# Altium schematic sheet Power-line.SchDoc
size A4; SheetNumber: 3; SheetTotal: 3
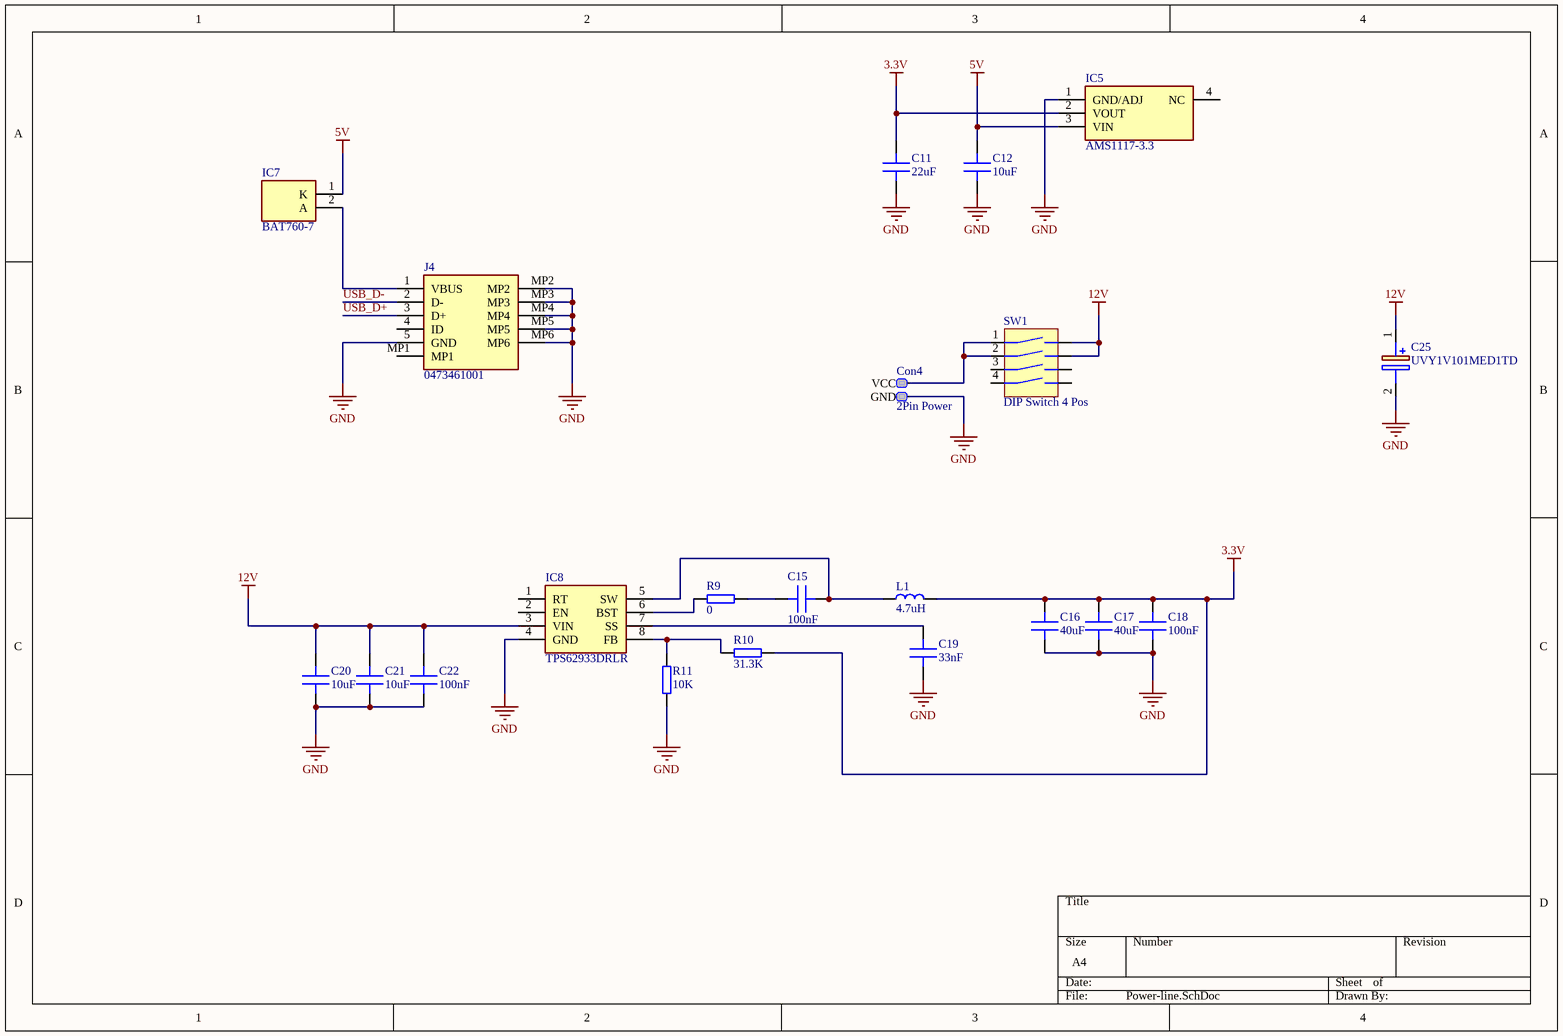
[diagram p0: Power-line.SchDoc]

## Parts
C11  22uF  [C 0805]
C12  10uF  [C 0805]
C15  100nF  [C 0402]
C16  40uF  [C 1206]
C17  40uF  [C 1206]
C18  100nF  [C 0603]
C19  33nF  [C 0402]
C20  10uF  [C 1206]
C21  10uF  [C 1206]
C22  100nF  [C 0603]
C25  UVY1V101MED1TD  [CAPPRD250W50D655H1250]
Con4  2Pin Power  [B2B-ZR-SM4A-TF]
IC5  AMS1117-3.3  [SOT229P700X180-4N]
IC7  BAT760-7  [SOD2513X120N]
IC8  TPS62933DRLR  [SOTFL50P160X60-8N]
J4  0473461001  [0473461001]
L1  4.7uH  [HPI0630]
R9  0  [R 0402]
R10  31.3K  [R 0402]
R11  10K  [R 0402]
SW1  DIP Switch 4 Pos  [DIP Switch 4 pos 2.54mm]

## Nets
3.3V: C11.1 C16.1 C17.1 C18.1 IC5.2(VOUT) L1.2 R10.1
5V: C12.1 IC5.3(VIN) IC7.1(K)
12V: C20.1 C21.1 C22.1 C25.1(+) IC8.3(VIN) SW1.7 SW1.8
GND: C11.2 C12.2 C16.2 C17.2 C18.2 C19.2 C20.2 C21.2 C22.2 C25.2(-) Con4.2(GND) IC5.1(GND/ADJ) IC8.4(GND) J4.5(GND) J4.MP2 J4.MP3 J4.MP4 J4.MP5 J4.MP6 R11.1
USB_D+: J4.3(D+)
USB_D-: J4.2(D-)
NetC15_1: C15.1 R9.1
NetC15_2: C15.2 IC8.5(SW) L1.1
NetC19_1: C19.1 IC8.7(SS)
NetCon4_1: Con4.1(VCC) SW1.1 SW1.2
NetIC7_2: IC7.2(A) J4.1(VBUS)
NetIC8_6: IC8.6(BST) R9.2
NetIC8_8: IC8.8(FB) R10.2 R11.2

Not connected (* = marked no-connect by the designer): IC5 4(NC); IC8 1(RT) 2(EN); J4 4(ID) MP1; SW1 3 4 5 6

## Library data of the parts
C11 C12 C15-C22 = Capacitor: MLCC Capacitor
C25 = UVY1V101MED1TD: Capacitor Polarised; Manufacturer_Name: Nichicon; Datasheet Link: http://nichicon-us.com/english/products/pdfs/e-uvy.pdf; Height: 12.5mm; Manufacturer_Part_Number: UVY1V101MED1TD; Arrow Part Number: UVY1V101MED1TD; Arrow Price/Stock: https://www.arrow.com/en/products/uvy1v101med1td/nichicon
IC5 = AMS1117-3.3: Integrated Circuit; Manufacturer_Name: Advanced; Datasheet Link: https://datasheet.datasheetarchive.com/originals/distributors/Datasheets-28/DSA-550594.pdf; Height: 1.8mm; Manufacturer_Part_Number: AMS1117-3.3
IC7 = BAT760-7: Integrated Circuit; Manufacturer_Name: Lattice Semiconductor; Datasheet Link: https://www.diodes.com/assets/Datasheets/ds30498.pdf; Height: 1.2mm; Manufacturer_Part_Number: BAT760-7; Mouser Part Number: N/A; Mouser Price/Stock: https://www.mouser.com/Search/Refine.aspx?Keyword=N%2FA
IC8 = TPS62933DRLR: Integrated Circuit; Manufacturer_Name: Texas Instruments; Datasheet Link: https://www.ti.com/lit/ds/symlink/tps62933.pdf?ts=1626073394234; Height: 0.6mm; Manufacturer_Part_Number: TPS62933DRLR; Mouser Part Number: 595-TPS62933DRLR; Mouser Price/Stock: https://www.mouser.co.uk/ProductDetail/Texas-Instruments/TPS62933DRLR?qs=Rp5uXu7WBW9fv47wfQVntQ%3D%3D; Arrow Part Number: TPS62933DRLR; Arrow Price/Stock: https://www.arrow.com/en/products/tps62933drlr/texas-instruments?utm_currency=USD&region=nac
J4 = 0473461001: Connector; Manufacturer_Name: Molex; Datasheet Link: https://componentsearchengine.com/Datasheets/1/0473461001.pdf; Height: 2.45mm; Manufacturer_Part_Number: 0473461001; Mouser Part Number: N/A; Mouser Price/Stock: https://www.mouser.co.uk/ProductDetail/Molex/0473461001?qs=2bnkQPT%252BPafTZgGVt%2FOGfA%3D%3D; Arrow Part Number: 0473461001; Arrow Price/Stock: https://www.arrow.com/en/products/0473461001/molex?region=nac
L1 = Inductor: General pourpouse inductor
R9-R11 = Resistor: General pourpouse resistor